# Altium schematic sheet 2_ESP32 SoC.schdoc.schdoc
size 309 x 223 mm; Symbol: Sheet-Symbol_A4; Device: Sheet-Symbol_A4; Company: EasyEDA.com; Drawed: EasyEDA Pro; Reviewed: EasyEDA Pro; Version: V0.1; Page Size: A4; @Project Name: AutoPilot; @Page Count: 3; @Update Date: 2023-12-14; @Create Date: 2023-10-27; @Schematic Name: Schematic1; Part Number: JLCPCB-002; @Page No: 2; @Page Name: ESP32 SoC
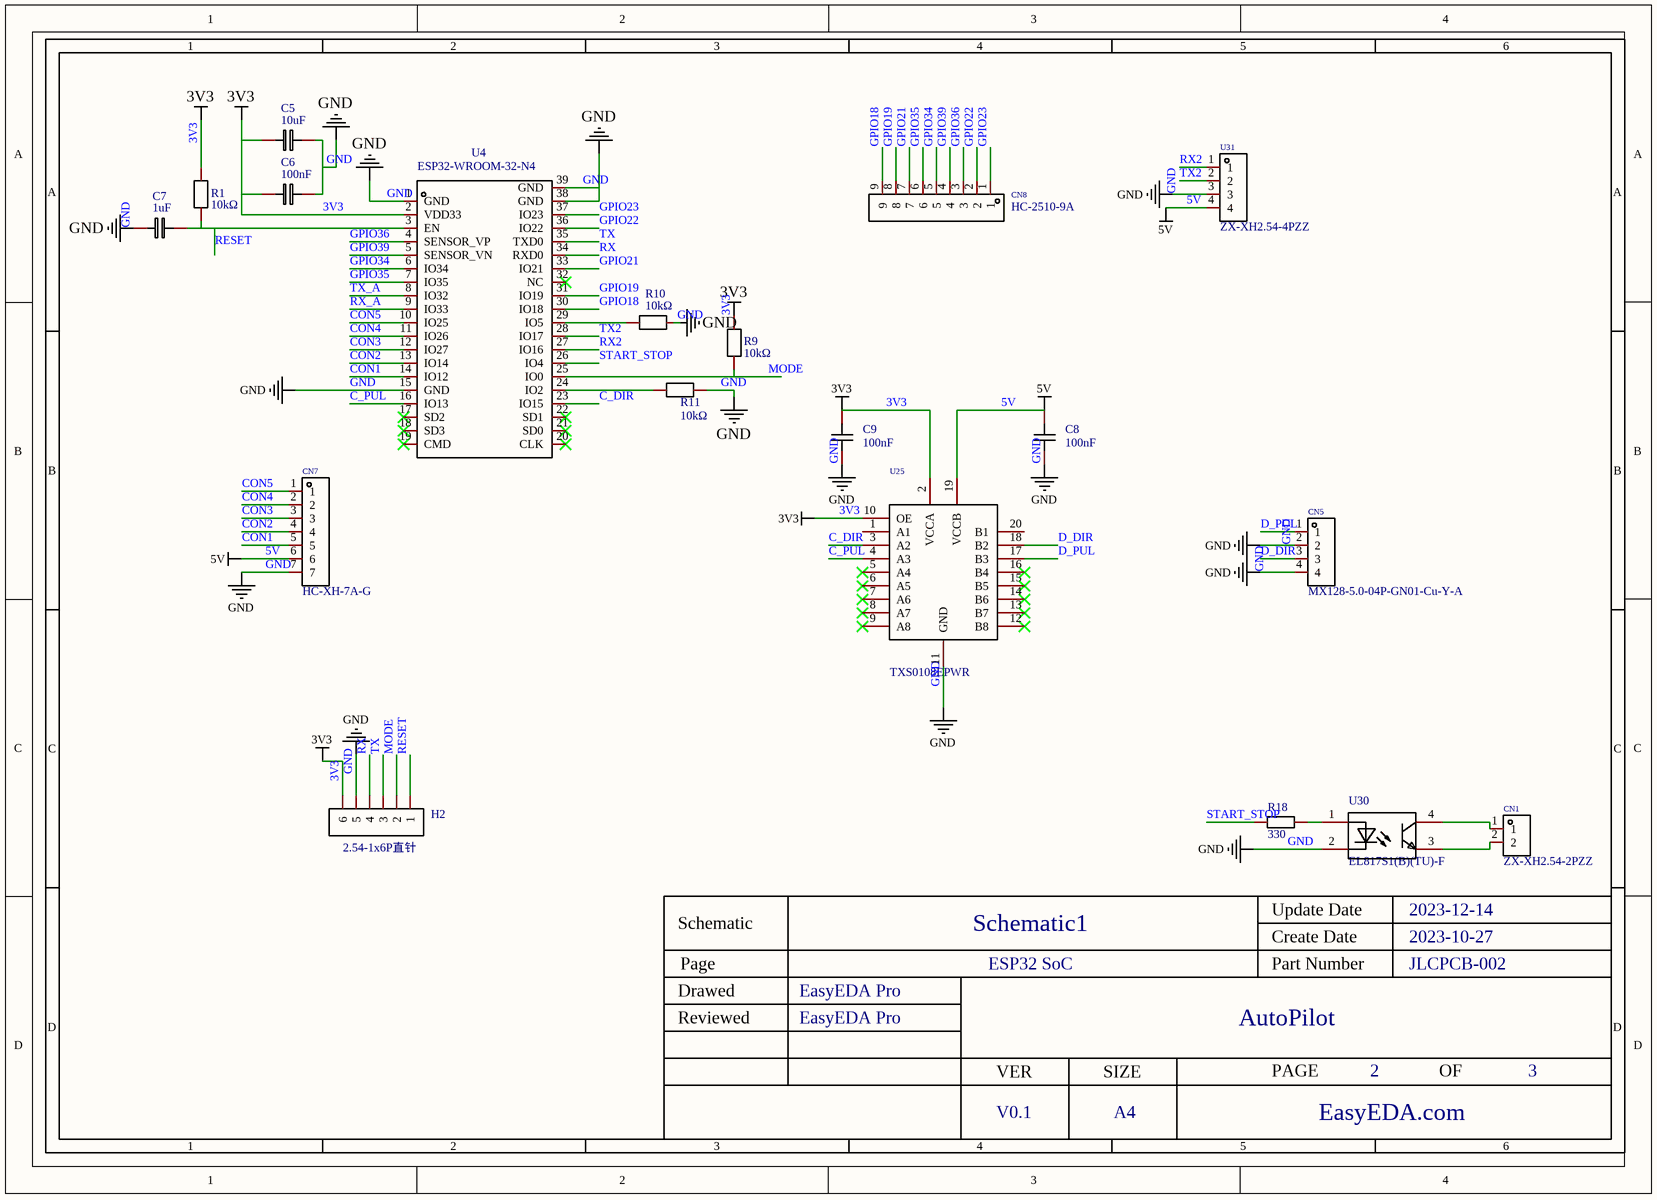
[diagram p0: 2_ESP32 SoC.schdoc.schdoc]

## Parts
C5  10uF  [C0603]
C6  100nF  [C0603]
C7  1uF  [C0603]
C8  100nF  [C0603]
C9  100nF  [C0603]
CN1  ZX-XH2.54-2PZZ  [CONN-TH_2P-P2.50_HX25003-2A]
CN5  MX128-5.0-04P-GN01-Cu-Y-A  [CONN-TH_4P-MX128-5.0-04P-GN01-CU-Y-A]
CN7  HC-XH-7A-G  [CONN-TH_7P-P2.50_HC-XH-7A-G]
CN8  HC-2510-9A  [CONN-TH_9P-P2.54_HCTL_HC-2510-9A]
H2  2.54-1x6P直针  [HDR-TH_6P-P2.54-V-M-1]
R1  10kΩ  [R0402]
R9  10kΩ  [R0402]
R10  10kΩ  [R0402]
R11  10kΩ  [R0402]
R18  330  [R0603]
U4  ESP32-WROOM-32-N4  [WIFIM-SMD_ESP32-WROOM-32-N4]
U25  TXS0108EPWR  [TSSOP-20_L6.5-W4.4-P0.65-LS6.4-BL]
U30  EL817S1(B)(TU)-F  [SOP-4_L6.5-W4.6-P2.54-LS10.2-TL]
U31  ZX-XH2.54-4PZZ  [CONN-TH_4P-P2.50_4PIN]

## Nets
3V3: C5.1 C6.1 C9.1 H2.6 R1.2 R9.2 U4.2(VDD33) U25.2(VCCA) U25.10(OE)
5V: C8.1 CN7.6 U25.19(VCCB) U31.4
GND: C5.2 C6.2 C7.1 C8.2 C9.2 CN5.2 CN5.4 CN7.7 H2.5 R10.2 R11.2 U4.1(GND) U4.15(GND) U4.38(GND) U4.39(GND) U25.11(GND) U30.2(CAT) U31.3
C_DIR: U4.23(IO15) U25.3(A2)
C_PUL: U4.16(IO13) U25.4(A3)
CON1: CN7.5 U4.14(IO12)
CON2: CN7.4 U4.13(IO14)
CON3: CN7.3 U4.12(IO27)
CON4: CN7.2 U4.11(IO26)
CON5: CN7.1 U4.10(IO25)
D_DIR: CN5.3 U25.18(B2)
D_PUL: CN5.1 U25.17(B3)
GPIO18: CN8.9 U4.30(IO18)
GPIO19: CN8.8 U4.31(IO19)
GPIO21: CN8.7 U4.33(IO21)
GPIO22: CN8.2 U4.36(IO22)
GPIO23: CN8.1 U4.37(IO23)
GPIO34: CN8.5 U4.6(IO34)
GPIO35: CN8.6 U4.7(IO35)
GPIO36: CN8.3 U4.4(SENSOR_VP)
GPIO39: CN8.4 U4.5(SENSOR_VN)
MODE: H2.2 R9.1 U4.25(IO0)
RESET: C7.2 H2.1 R1.1 U4.3(EN)
RX: H2.4 U4.34(RXD0)
RX2: U4.27(IO16) U31.1
RX_A: U4.9(IO33)
START_STOP: R18.1 U4.26(IO4)
TX: H2.3 U4.35(TXD0)
TX2: U4.28(IO17) U31.2
TX_A: U4.8(IO32)
NetCN1_1: CN1.1 U30.4(COL)
NetCN1_2: CN1.2 U30.3(EM)
NetR10_1: R10.1 U4.29(IO5)
NetR11_1: R11.1 U4.24(IO2)
NetR18_2: R18.2 U30.1(AN)

Not connected (* = marked no-connect by the designer): U4 17(SD2)* 18(SD3)* 19(CMD)* 20(CLK)* 21(SD0)* 22(SD1)* 32(NC)*; U25 1(A1) 5(A4)* 6(A5)* 7(A6)* 8(A7)* 9(A8)* 12(B8)* 13(B7)* 14(B6)* 15(B5)* 16(B4)* 20(B1)

## Notes on the sheet
- 1
- 2
- 3
- 4
- 5
- 6
- A
- B
- C
- Schematic
- Schematic1
- Create Date
- Update Date
- 2023-12-14
- 2023-10-27
- Reviewed
- Drawed
- Page
- EasyEDA Pro
- ESP32 SoC
- Part Number
- AutoPilot
- JLCPCB-002
- D
- VER
- SIZE
- PAGE
- OF
- V0.1
- A4
- EasyEDA.com

## Library data of the parts
C5 = CL10A106MQ8NNNC: Capacitance: Tolerance:±20% Tolerance:±20% Voltage Rated: Temperature Coefficient:; Manufacturer: SAMSUNG(三星); Symbol: 10u; Add into BOM: yes; Tolerance: ±20%; Name: 10uF; Device: CL10A106MQ8NNNC; LCSC Part Name: 10uF±20%6.3V; Supplier Part: C1691; Manufacturer Part: CL10A106MQ8NNNC; Supplier Footprint: 0603; JLCPCB Part Class: ExtendedPart; Datasheet: https://atta.szlcsc.com/upload/public/pdf/source/20160103/1457707690948.pdf; Supplier: LCSC; Convert to PCB: yes; Value: 10uF; Origin Footprint: C0603
C6 = 0.1u: Manufacturer Part: C0603C104K5RACAUTO; Manufacturer: KEMET(基美); Convert to PCB: yes; Name: 100nF; Symbol: 0.1u; Device: 0.1u; Supplier Part: C129621; Supplier: LCSC; Add into BOM: yes; Origin Footprint: C0603
C7 = 1u: Manufacturer Part: CC0603ZRY5V8BB105; Manufacturer: YAGEO(国巨); Convert to PCB: yes; Name: 1uF; Symbol: 1u; Device: 1u; Supplier Part: C106848; Supplier: LCSC; Add into BOM: yes; Origin Footprint: C0603
C8 C9 = CAP_0603: Symbol: CAP; Convert to PCB: yes; Name: 100nF; Device: CAP_0603; Add into BOM: yes; Supplier Footprint: 0603; Value: 100nF
CN1 = ZX-XH2.54-2PZZ: Pins Structure:1x2P Pitch:2.54mm Gender:公 Mounting Style:Straight Row Spacing:- Number of Rows:1 Number of PINs Per Row:2 Reference Series:XH Current Rating (Max):3A Contact Material:Brass Contact Plating:Tin Operating Temperature Range:-25℃~+85℃ Operatin; Manufacturer: Megastar(兆星); Add into BOM: yes; Pins Structure: 1x2P; Pitch: 2.54mm; Gender: 公; Number of PINs Per Row: 2; Reference Series: XH; Current Rating (Max): 3A; Welding Temperature (Max): 260℃; Name: ZX-XH2.54-2PZZ; Symbol: ZX-XH2.54-2PZZ; Device: ZX-XH2.54-2PZZ; LCSC Part Name: 1x2P 间距:2.54mm 直插 系列:XH; Supplier Part: C7429632; Manufacturer Part: ZX-XH2.54-2PZZ; Supplier Footprint: 插件,P=2.54mm; JLCPCB Part Class: Extended Part; Datasheet: https://atta.szlcsc.com/upload/public/pdf/source/20230619/19BA6947230AA44A04D3EDD65E618FD0.pdf; Supplier: LCSC; Convert to PCB: yes; Mounting Style: Straight; Row Spacing: -; Number of Rows: 1; Contact Material: Brass; Contact Plating: Tin; Operating Temperature Range: -25℃~+85℃
CN5 = MX128-5.0-04P-GN01-Cu-Y-A: Pitch:5mm Number of Pins:4P Number of Rows:1 Current Rating (Max):10A Voltage Rating (Max):300V Wire Gauge - AWG:12~24 Wire Gauge - AWG:12~24 Contact Material:Copper Alloy Contact Plating:Tin Operating Temperature Range:-40℃~+105℃ Operating Temperature Ra; Manufacturer: MAX(迈旭); Add into BOM: yes; Pitch: 5mm; Current Rating (Max): 10A; Voltage Rating (Max): 300V; Wire Gauge - AWG: 12~24; Number of PINs Per Row: 4; Name: MX128-5.0-04P-GN01-Cu-Y-A; Symbol: MX128-5.0-04P-GN01-CU-Y-A; Device: MX128-5.0-04P-GN01-Cu-Y-A; LCSC Part Name: 5mm 排数:1 每排P数:4; Supplier Part: C5290369; Manufacturer Part: MX128-5.0-04P-GN01-Cu-Y-A; Supplier Footprint: 直插,P=5.0mm; Datasheet: https://atta.szlcsc.com/upload/public/pdf/source/20230914/7C59C50CB6A87747FF89F939B009DABF.pdf; Supplier: LCSC; Convert to PCB: yes; Number of Pins: 4P; Number of Rows: 1; Contact Material: Copper Alloy; Contact Plating: Tin; Operating Temperature Range: -40℃~+105℃; Color: Green
CN7 = HC-XH-7A-G: Pins Structure:1x7P Pitch:2.54mm Mounting Style:Straight Row Spacing:2.54mm Number of Pins:7P Number of Rows:1 Number of PINs Per Row:6 Reference Series:XH Current Rating (Max):3A Operating Temperature Range:-25℃~+85℃ Operating Temperature Range:-25℃~+85℃; Manufacturer: HCTL(华灿天禄); Add into BOM: yes; Pins Structure: 1x7P; Pitch: 2.54mm; Number of PINs Per Row: 6; Reference Series: XH; Current Rating (Max): 3A; Name: HC-XH-7A-G; Symbol: HC-XH-7A-G; Device: HC-XH-7A-G; LCSC Part Name: 1x7P 间距:2.54mm 直插 系列:XH; Supplier Part: C5341206; Manufacturer Part: HC-XH-7A-G; Supplier Footprint: 插件,P=2.5mm; JLCPCB Part Class: Extended Part; Datasheet: https://atta.szlcsc.com/upload/public/pdf/source/20230711/68D365716984B4AFE576D1D73D61B465.pdf; Supplier: LCSC; Convert to PCB: yes; Mounting Style: Straight; Row Spacing: 2.54mm; Number of Pins: 7P; Number of Rows: 1; Operating Temperature Range: -25℃~+85℃
CN8 = HC-2510-9A: Pins Structure:1x9P Pitch:2.54mm Mounting Style:Straight Row Spacing:- Number of Pins:9P Number of Rows:1 Number of PINs Per Row:9 Reference Series:- Current Rating (Max):4A Operating Temperature Range:-25℃~+85℃ Operating Temperature Range:-25℃~+85℃; Manufacturer: HCTL(华灿天禄); Add into BOM: yes; Pins Structure: 1x9P; Pitch: 2.54mm; Number of PINs Per Row: 9; Current Rating (Max): 4A; Name: HC-2510-9A; Symbol: HC-2510-9A; Device: HC-2510-9A; LCSC Part Name: 1x9P 间距:2.54mm 直插 1x9P 间距P= 带靠背 直针; Supplier Part: C2982038; Manufacturer Part: HC-2510-9A; Supplier Footprint: 插件,P=2.54mm; JLCPCB Part Class: Extended Part; Datasheet: https://atta.szlcsc.com/upload/public/pdf/source/20220311/83CB9A6B67C6DEDDA2AF08A1DCFC516E.pdf; Supplier: LCSC; Convert to PCB: yes; Mounting Style: Straight; Row Spacing: -; Number of Pins: 9P; Number of Rows: 1; Reference Series: -; Operating Temperature Range: -25℃~+85℃
H2 = 2.54-1x6P直针: Number of Rows:单排 Number of Pins:6 Pitch:2.54mm Pin Structure:1x6P Row Spacing:- Mounting Type:Straight Circluar Pins/Square Pins:Square Pins Current Rating (Max):3A Voltage Rating (Max):- Length of Mating Pin:- Insulation Height:- Contact Material: Conta; Manufacturer: BOOMELE(博穆精密); Symbol: Header-Male-2.54_1x6; Add into BOM: yes; Pitch: 2.54mm; Pin Structure: 1x6P; Current Rating (Max): 3A; Name: 2.54-1x6P直针; Device: 2.54-1x6P直针; LCSC Part Name: 2.54mm 1x6P 直插 方针; Supplier Part: C37208; Manufacturer Part: 2.54-1x6P直针; Supplier Footprint: 直插,P=2.54mm; JLCPCB Part Class: Extended Part; Supplier: LCSC; Convert to PCB: yes; Number of Rows: 单排; Number of Pins: 6; Row Spacing: -; Mounting Type: Straight; Circluar Pins/Square Pins: Square Pins; Voltage Rating (Max): -; Length of Mating Pin: -; Insulation Height: -; Contact Plating: -; Operating Temperature Range: -40℃~+105℃; Color: Black
R1 R9 R10 = SCR0402F10K: Resistance: Tolerance:±1% Tolerance:±1%; Manufacturer: VO(翔胜); Symbol: 10k; Add into BOM: yes; Tolerance: ±1%; Name: 10kΩ; Device: SCR0402F10K; LCSC Part Name: 10kΩ±1%; Supplier Part: C3015825; Manufacturer Part: SCR0402F10K; Supplier Footprint: 0402; JLCPCB Part Class: ExtendedPart; Datasheet: https://atta.szlcsc.com/upload/public/pdf/source/20220513/247AF9639BA21CF93567DC289CCC6A22.pdf; Supplier: LCSC; Convert to PCB: yes; Value: 10kΩ; Origin Footprint: R0402
R11 = SCR0402F10K: Resistance: Tolerance:±1% Tolerance:±1%; Manufacturer: VO(翔胜); Symbol: 10k; Add into BOM: yes; Tolerance: ±1%; Origin Footprint: R0603; Name: 10kΩ; Device: SCR0402F10K; LCSC Part Name: 10kΩ±1%; Supplier Part: C3015825; Manufacturer Part: SCR0402F10K; Supplier Footprint: 0402; JLCPCB Part Class: ExtendedPart; Datasheet: https://atta.szlcsc.com/upload/public/pdf/source/20220513/247AF9639BA21CF93567DC289CCC6A22.pdf; Supplier: LCSC; Convert to PCB: yes; Value: 10kΩ
R18 = Res_0603: Symbol: Res; Convert to PCB: yes; Name: 330; Device: Res_0603; Add into BOM: yes; Supplier Footprint: 0603; Value: 330
U4 = ESP32-WROOM-32-N4: Manufacturer: ESPRESSIF(乐鑫); Symbol: ESP32-WROOM-32(16MB); Add into BOM: yes; Origin Footprint: WIFIM-SMD_39P-L25.5-W18.0-P1.27; Name: ESP32-WROOM-32-N4; Device: ESP32-WROOM-32-N4; LCSC Part Name: ESP32-WROOM-32-N4; Supplier Part: C82899; Manufacturer Part: ESP32-WROOM-32-N4; Supplier Footprint: WIFI无线Module; JLCPCB Part Class: Extended Part; Datasheet: https://atta.szlcsc.com/upload/public/pdf/source/20210719/C82899_2D52724B6FAFABC419BCF308C5944296.pdf; Supplier: LCSC; Convert to PCB: yes; link: https://lcsc.com/eda_search?q=C529581&amp;%26type=1&amp;ref=editor
U25 = TXS0108EPWR: Channel Type:Bi-Directional Number of Circuits:1 Channels per Circuit:8 Supply Voltage (VCCA):1.4V~3.6V Supply Voltage (VCCA):1.4V~3.6V Supply Voltage (VCCB):1.65V~5.5V Supply Voltage (VCCB):1.65V~5.5V Input Signal:- Output Signal:- Output Type:Open Drain; Manufacturer: TI(德州仪器); Add into BOM: yes; Number of Circuits: 1; Channels per Circuit: 8; Output Type: Open Drain；Push-pull; Data Rate: 60Mbps; Name: TXS0108EPWR; Symbol: TXS0108EPWR; Device: TXS0108EPWR; LCSC Part Name: 60Mbps 8位双向电平转换器; Supplier Part: C17206; Manufacturer Part: TXS0108EPWR; Supplier Footprint: TSSOP-20; JLCPCB Part Class: Extended Part; Datasheet: http://www.ti.com/cn/lit/gpn/txs0108e; Supplier: LCSC; Convert to PCB: yes; Channel Type: Bi-Directional; Supply Voltage (VCCA): 1.4V~3.6V; Supply Voltage (VCCB): 1.65V~5.5V; Input Signal: -; Output Signal: -; Operating Temperature: -40℃~+85℃; Features: 自动方向检测
U30 = EL817S1(B)(TU)-F: Input voltage type:DC Output Type:光电三极管 Number of Outputs:1 Forward Voltage:1.2V Reverse Voltage:6V Output Current:50mA Receiving End Voltage:35V Collector-Emitter Saturation Voltage (Vce(sat)@Ic,IF):0.1V@1mA,20mA Rise time:4us@2mA,100Ω Fall time:3us@2mA,; Manufacturer: EVERLIGHT(亿光); Add into BOM: yes; Input voltage type: DC; Output Type: 光电三极管; Number of Outputs: 1; Forward Voltage: 1.2V; Reverse Voltage: 6V; Output Current: 50mA; Receiving End Voltage: 35V; Fall time: 3us@2mA,100Ω; Isolation Voltage(rms): 5000V; Name: EL817S1(B)(TU)-F; Symbol: EL817S1(B)(TU)-F; Device: EL817S1(B)(TU)-F; LCSC Part Name: DC输入 隔离电压(rms):5000V; Supplier Part: C63268; Manufacturer Part: EL817S1(B)(TU)-F; Supplier Footprint: SOP-4-2.54mm; JLCPCB Part Class: Extended Part; Datasheet: https://atta.szlcsc.com/upload/public/pdf/source/20160318/1458266987275.pdf; Supplier: LCSC; Convert to PCB: yes; Collector-Emitter Saturation Voltage (Vce(sat)@Ic,IF): 0.1V@1mA,20mA; Rise time: 4us@2mA,100Ω; Operating Temperature: -55℃~+110℃
U31 = ZX-XH2.54-4PZZ: Reference Series:XH Pitch:2.54mm Pins Structure:1x4P Number of Rows:1 Number of PINs Per Row:4 Row Spacing:- Gender:公型插针 Mounting Style:Straight Current Rating (Max):3A Contact Material:Brass Contact Plating:Tin Operating Temperature Range:-25℃~+85℃ Opera; Manufacturer: Megastar(兆星); Add into BOM: yes; Reference Series: XH; Pitch: 2.54mm; Pins Structure: 1x4P; Number of PINs Per Row: 4; Gender: 公型插针; Current Rating (Max): 3A; Welding Temperature (Max): 260℃; Name: ZX-XH2.54-4PZZ; Symbol: ZX-XH2.54-4PZZ; Device: ZX-XH2.54-4PZZ; LCSC Part Name: 系列:XH 间距:2.54mm 1x4P 直插; Supplier Part: C7429634; Manufacturer Part: ZX-XH2.54-4PZZ; Supplier Footprint: 插件,P=2.54mm; JLCPCB Part Class: Extended Part; Datasheet: https://atta.szlcsc.com/upload/public/pdf/source/20230619/B529A2163E0159A644AB3383D208FB03.pdf; Supplier: LCSC; Convert to PCB: yes; Number of Rows: 1; Row Spacing: -; Mounting Style: Straight; Contact Material: Brass; Contact Plating: Tin; Operating Temperature Range: -25℃~+85℃